# EAGLE schematic v001 (EAGLE 6.4)
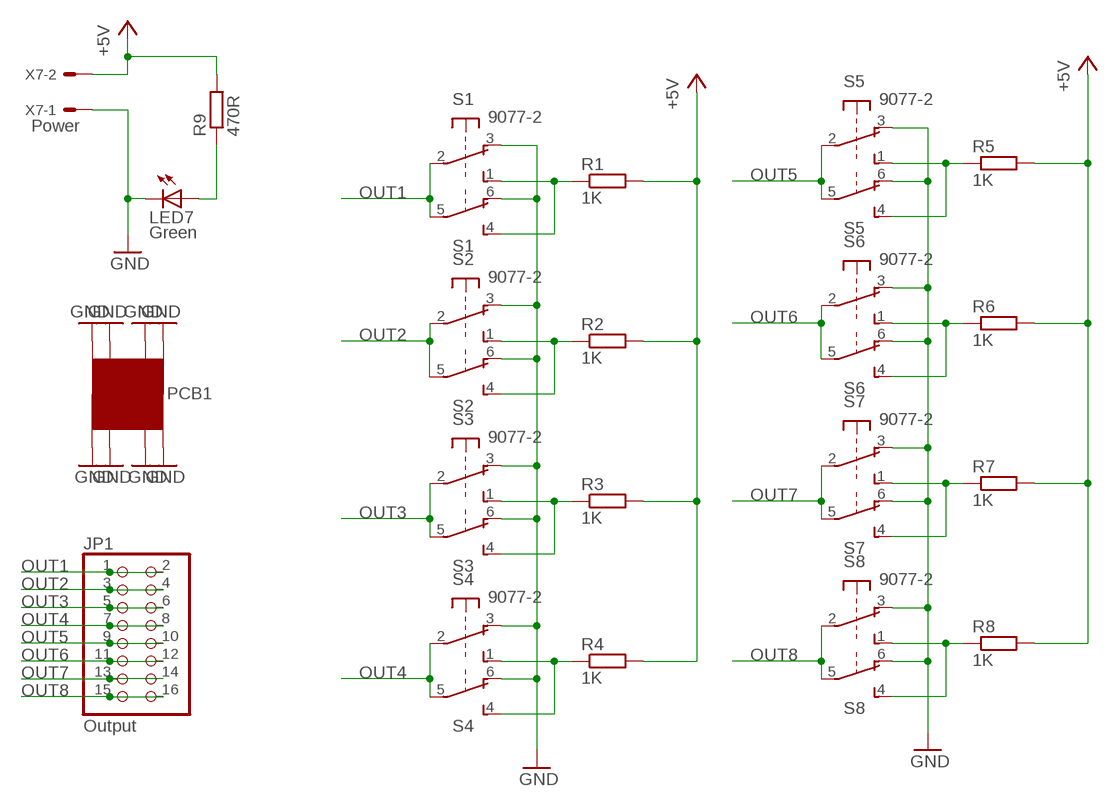
[diagram p0: schematic, sheet 1]

## Parts
JP1  Output  PINHD-2X8  [2X08]
LED7  Green  LED3MM  [LED3MM]
PCB1  PCB05X05  [PCB_05X05]
R1  1K  R-EU_0207/2V  [0207/2V]
R2  1K  R-EU_0207/2V  [0207/2V]
R3  1K  R-EU_0207/2V  [0207/2V]
R4  1K  R-EU_0207/2V  [0207/2V]
R5  1K  R-EU_0207/2V  [0207/2V]
R6  1K  R-EU_0207/2V  [0207/2V]
R7  1K  R-EU_0207/2V  [0207/2V]
R8  1K  R-EU_0207/2V  [0207/2V]
R9  470R  R-EU_0207/2V  [0207/2V]
S1  9077-2  [9077-2]
S2  9077-2  [9077-2]
S3  9077-2  [9077-2]
S4  9077-2  [9077-2]
S5  9077-2  [9077-2]
S6  9077-2  [9077-2]
S7  9077-2  [9077-2]
S8  9077-2  [9077-2]
X7  Power  22-27-2021-02  [6410-02]

## Nets
+5V: R1.2 R2.2 R3.2 R4.2 R5.2 R6.2 R7.2 R8.2 R9.2 X7.2
GND: LED7.K(C) PCB1.GND@1(GND) PCB1.GND@2(GND) PCB1.GND@3(GND) PCB1.GND@4(GND) PCB1.GND@5(GND) PCB1.GND@6(GND) PCB1.GND@7(GND) PCB1.GND@8(GND) S1.3(1:O) S1.6(2:O) S2.3(1:O) S2.6(2:O) S3.3(1:O) S3.6(2:O) S4.3(1:O) S4.6(2:O) S5.3(1:O) S5.6(2:O) S6.3(1:O) S6.6(2:O) S7.3(1:O) S7.6(2:O) S8.3(1:O) S8.6(2:O) X7.1
N$1: R4.1 S4.1(1:S) S4.4(2:S)
N$2: R3.1 S3.1(1:S) S3.4(2:S)
N$3: R2.1 S2.1(1:S) S2.4(2:S)
N$4: R1.1 S1.1(1:S) S1.4(2:S)
N$5: R8.1 S8.1(1:S) S8.4(2:S)
N$6: R7.1 S7.1(1:S) S7.4(2:S)
N$7: R6.1 S6.1(1:S) S6.4(2:S)
N$8: R5.1 S5.1(1:S) S5.4(2:S)
N$20: LED7.A R9.1
OUT1: JP1.1 JP1.2 S1.2(1:P) S1.5(2:P)
OUT2: JP1.3 JP1.4 S2.2(1:P) S2.5(2:P)
OUT3: JP1.5 JP1.6 S3.2(1:P) S3.5(2:P)
OUT4: JP1.7 JP1.8 S4.2(1:P) S4.5(2:P)
OUT5: JP1.9 JP1.10 S5.2(1:P) S5.5(2:P)
OUT6: JP1.11 JP1.12 S6.2(1:P) S6.5(2:P)
OUT7: JP1.13 JP1.14 S7.2(1:P) S7.5(2:P)
OUT8: JP1.15 JP1.16 S8.2(1:P) S8.5(2:P)

## Library data of the parts
JP1 = pinhead:PINHD-2X8: PIN HEADER
LED7 = led:LED: LED OSRAM: - CHIPLED LG R971, LG N971, LY N971, LG Q971, LY Q971, LO R971, LY R971 LH N974, LH R974 LS Q976, LO Q976, LY Q976 LO Q996 - Hyper CHIPLED LW Q18S LB Q993, LB Q99A, LB R99A - SideLED LS A670, LO A670, LY A670, LG A670, LP A670 LB A673, LV A673, LT A673, LW A673 LH A674 LY A675 LS A676, LA A676, LO A676, LY A676, LW A676 LS A679, LY A679, LG A679 - Hyper Micro SIDELED® LS Y876, LA Y876, LO Y876, LY Y876 LT Y87S - SmartLED LW L88C, LW L88S LB L89C, LB L89S, LG L890 LS L89K, LO L89K, LY L89K LS L896, LA L896, LO L896, LY L896 - TOPLED LS T670, LO T670, LY T670, LG T670, LP T670 LSG T670, LSP T670, LSY T670, LOP T670, LYG T670 LG T671, LOG T671, LSG T671 LB T673, LV T673, LT T673, LW T673 LH T674 LS T676, LA T676, LO T676, LY T676, LB T676, LH T676, LSB T676, LW T676 LB T67C, LV T67C, LT T67C, LS T67K, LO T67K, LY T67K, LW E67C LS E67B, LA E67B, LO E67B, LY E67B, LB E67C, LV E67C, LT E67C LW T67C LS T679, LY T679, LG T679 LS T770, LO T770, LY T770, LG T770, LP T770 LB T773, LV T773, LT T773, LW T773 LH T774 LS E675, LA E675, LY E675, LS T675 LS T776, LA T776, LO T776, LY T776, LB T776 LHGB T686 LT T68C, LB T68C - Hyper Mini TOPLED® LB M676 - Mini TOPLED Santana® LG M470 LS M47K, LO M47K, LY M47K Source: http://www.osram.convergy.de LUXEON: - LUMILED® LXK2-PW12-R00, LXK2-PW12-S00, LXK2-PW14-U00, LXK2-PW14-V00 LXK2-PM12-R00, LXK2-PM12-S00, LXK2-PM14-U00 LXK2-PE12-Q00, LXK2-PE12-R00, LXK2-PE12-S00, LXK2-PE14-T00, LXK2-PE14-U00 LXK2-PB12-K00, LXK2-PB12-L00, LXK2-PB12-M00, LXK2-PB14-N00, LXK2-PB14-P00, LXK2-PB14-Q00 LXK2-PR12-L00, LXK2-PR12-M00, LXK2-PR14-Q00, LXK2-PR14-R00 LXK2-PD12-Q00, LXK2-PD12-R00, LXK2-PD12-S00 LXK2-PH12-R00, LXK2-PH12-S00 LXK2-PL12-P00, LXK2-PL12-Q00, LXK2-PL12-R00 Source: www.luxeon.com KINGBRIGHT: KA-3528ASYC Source: www.kingbright.com
PCB1 = GNLib:PCB
R1-R8 = rcl:R-EU_: RESISTOR, European symbol
R9 = resistor:R-EU_: RESISTOR, European symbol
S1-S8 = switch-misc:9077-2: MARQUARDT SWITCH 9077.0200 Distributor: Buerklin <https://www.buerklin.com/default.asp?event=ShowArtikel%2812G2822%29&l=d&jump=ArtNr_12G2822>
X7 = con-molex:22-?-02: CONNECTOR wire to board 2.54 mm (.1 inch) pitch header; OC_FARNELL: unknown; OC_NEWARK: unknown